# Altium schematic sheet Hardware Achitecture.SchDoc
size A3; Date: 27.05.2014; DrawnBy: luths8; Organization: BFH; Address1: Bern University of Applied Sciences; Address2: Engineering and Information Technology; Address3: Jlcoweg 1; Address4: CH-3400 Burgdorf; DocumentNumber: 1; Revision: 1.1; SheetNumber: 1; SheetTotal: 5; CurrentDate: 27.05.2014
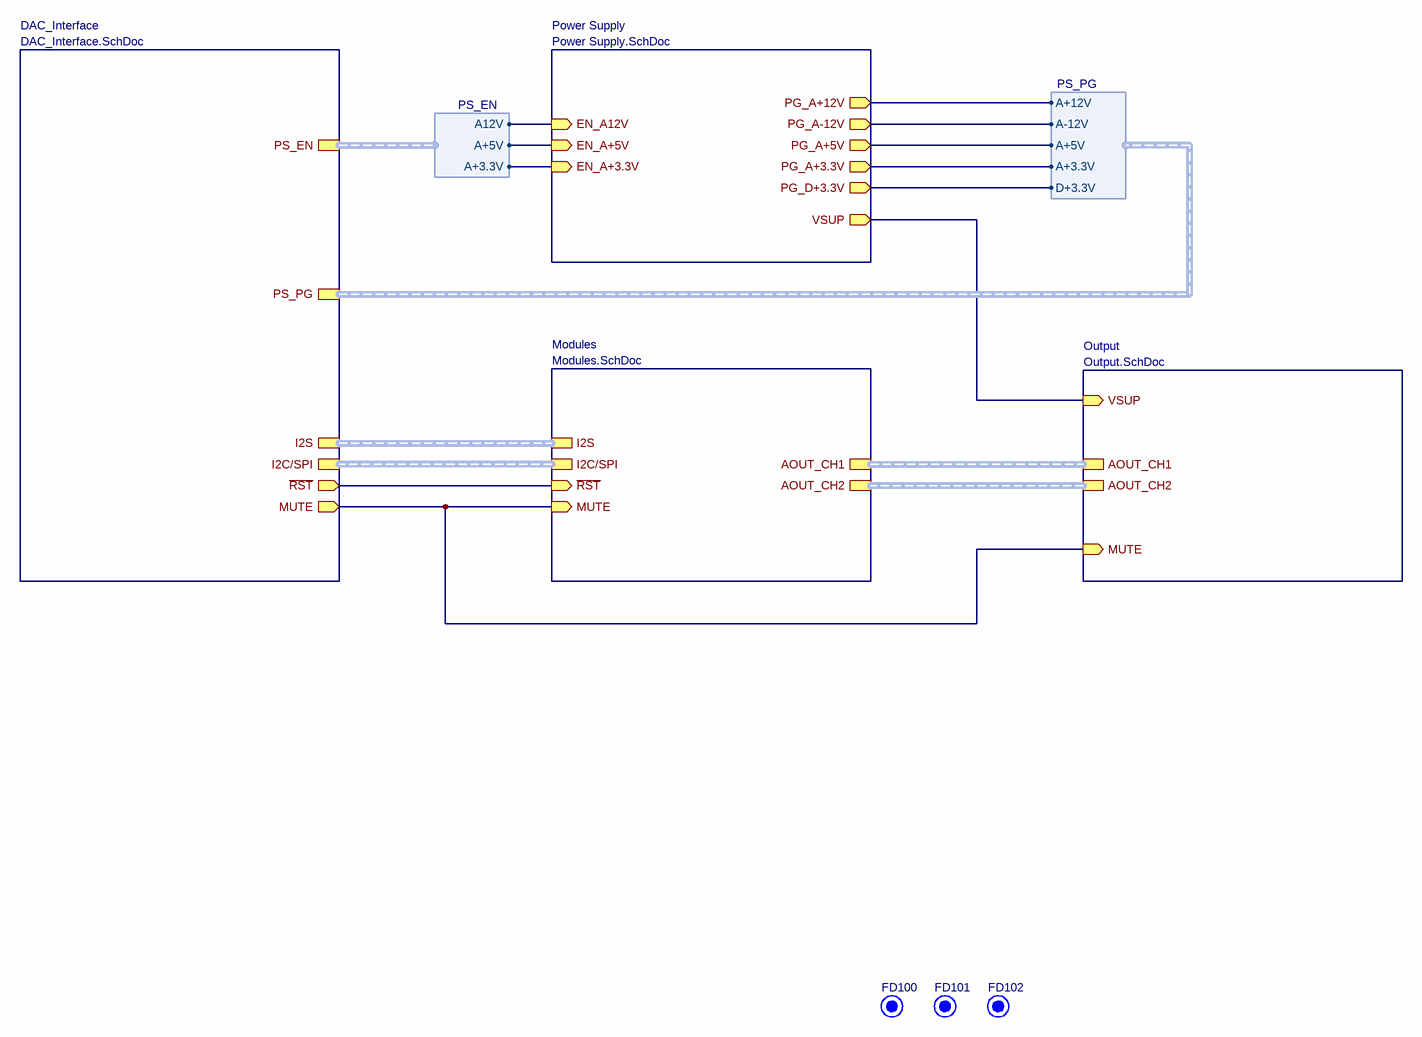
[diagram p0: Hardware Achitecture.SchDoc]

## Parts
FD100  Fiducial  [FIDUCIAL]  (value not drawn)  (no BOM)
FD101  Fiducial  [FIDUCIAL]  (value not drawn)  (no BOM)
FD102  Fiducial  [FIDUCIAL]  (value not drawn)  (no BOM)

## Sub-sheets
DAC_Interface = DAC_Interface.SchDoc: I2C/SPI (harness I2C/SPI), ~{RST} (out), I2S (harness I2S), MUTE (out), PS_PG (harness PS_PG), PS_EN (harness PS_EN)
Modules = Modules.SchDoc: I2C/SPI (harness I2C/SPI), ~{RST} (in), I2S (harness I2S), MUTE (in), AOUT_CH2 (harness AOUT), AOUT_CH1 (harness AOUT)
Output = Output.SchDoc: MUTE (in), VSUP (in), AOUT_CH2 (harness AOUT), AOUT_CH1 (harness AOUT)
Power Supply = Power Supply.SchDoc: PG_A-12V (out), EN_A12V (in), PG_A+3.3V (out), PG_D+3.3V (out), EN_A+3.3V (in), PG_A+12V (out), VSUP (out), EN_A+5V (in), PG_A+5V (out)

## Harnesses
PS_EN: A12V, A+3.3V, A+5V
PS_PG: A+12V, A-12V, A+3.3V, D+3.3V, A+5V

## Nets
(unnamed): sheet Power Supply/PG_A-12V, sheet DAC_Interface/PS_PG.A-12V
(unnamed): sheet Power Supply/EN_A12V, sheet DAC_Interface/PS_EN.A12V
(unnamed): sheet Power Supply/PG_A+3.3V, sheet DAC_Interface/PS_PG.A+3.3V
(unnamed): sheet Power Supply/PG_D+3.3V, sheet DAC_Interface/PS_PG.D+3.3V
(unnamed): sheet Power Supply/EN_A+3.3V, sheet DAC_Interface/PS_EN.A+3.3V
(unnamed): sheet Power Supply/PG_A+12V, sheet DAC_Interface/PS_PG.A+12V
(unnamed): sheet Power Supply/VSUP, sheet Output/VSUP
(unnamed): sheet Power Supply/EN_A+5V, sheet DAC_Interface/PS_EN.A+5V
(unnamed): sheet Power Supply/PG_A+5V, sheet DAC_Interface/PS_PG.A+5V
(unnamed): sheet DAC_Interface/~{RST}, sheet Modules/~{RST}
(unnamed): sheet DAC_Interface/MUTE, sheet Modules/MUTE, sheet Output/MUTE

## Buses and harness runs
harness sheet DAC_Interface/I2C/SPI = sheet Modules/I2C/SPI
harness sheet DAC_Interface/I2S = sheet Modules/I2S
harness sheet Modules/AOUT_CH1 = sheet Output/AOUT_CH1
harness sheet Modules/AOUT_CH2 = sheet Output/AOUT_CH2

## Notes on the sheet
- Project:
- Size:
- Sheet:
- Title:
- A3
- of
- Drawn by:
- Revision:
- Date:
- Variant:
- b
- File:

## Library data of the parts
FD100-FD102 = Fiducial: Fiducial Marker